# Altium project 2GHz_TDD_Driver.PrjPcb
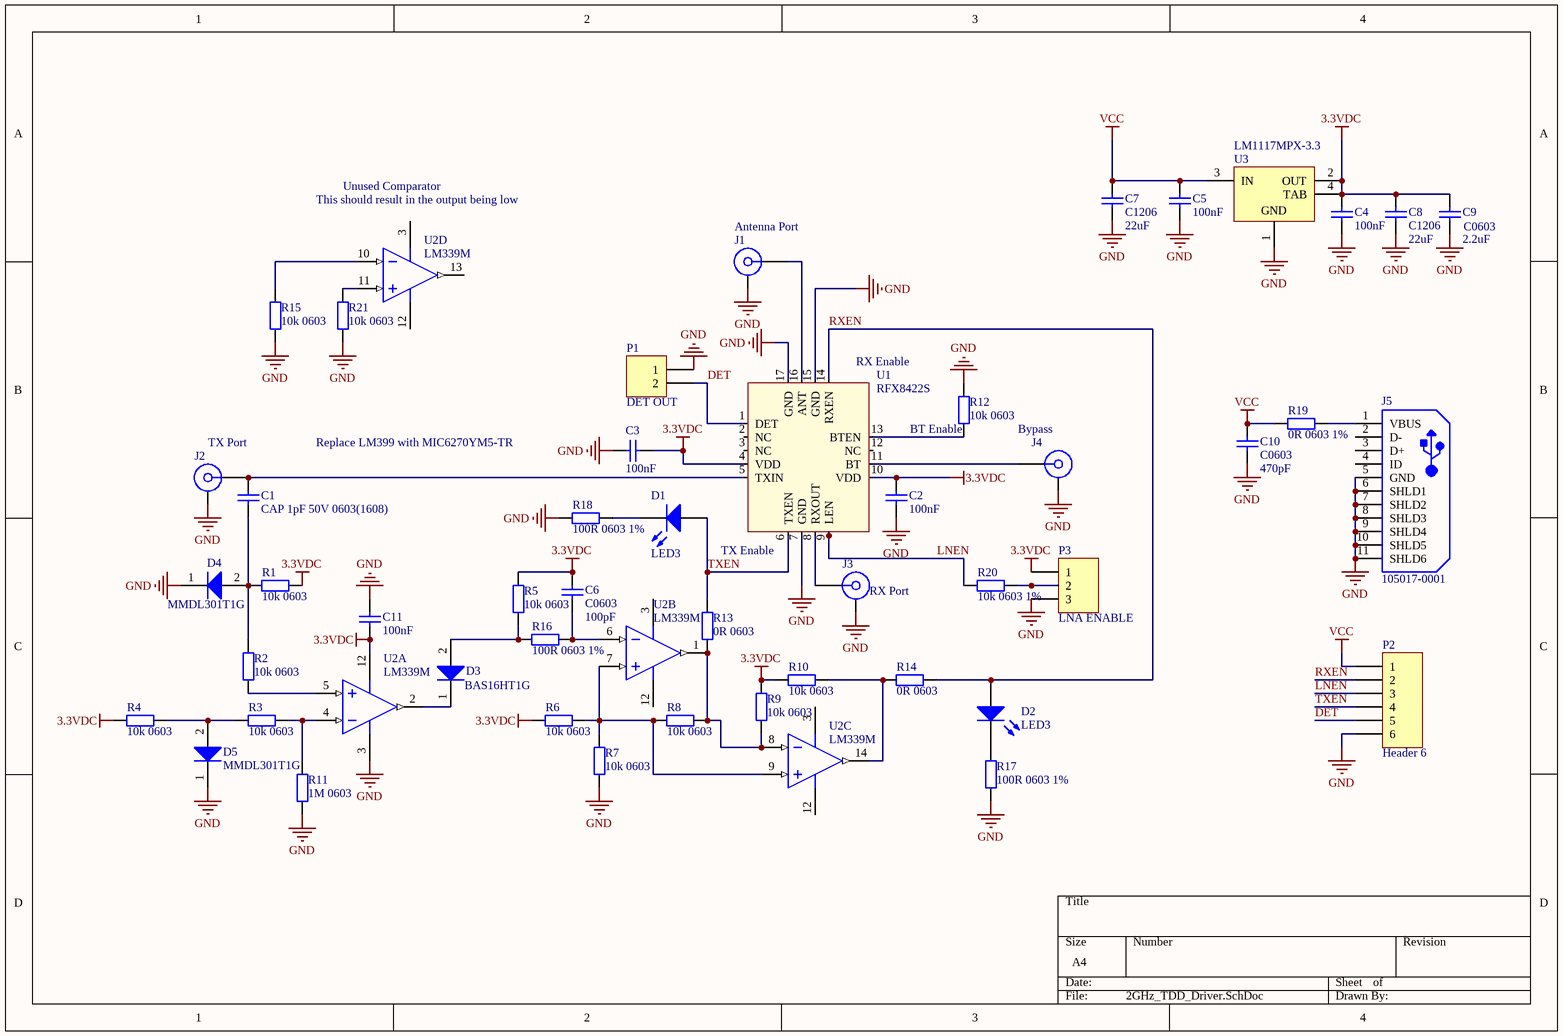
[diagram p0: 2GHz_TDD_Driver.SchDoc]
1 sheet, 48 parts. Net scope: global (net labels, ports and power ports of the same name join across sheets).
Board file: 2GHz_TDD_Driver.PcbDoc

## Sheet 2GHz_TDD_Driver.SchDoc: 2.4GHz TDD Driver
size A4; SheetNumber: 1; SheetTotal: 1; DocumentName: 2.4GHz TDD Driver; ProjectName: 2.4GHz TDD Driver

### Parts
C1  CAP 1pF 50V 0603(1608)  [CAPC0603(1608)100_M]
C2  100nF  [CAPC0603(1608)100_N]
C3  100nF  [CAPC0603(1608)100_N]
C4  100nF  [CAPC0603(1608)100_N]
C5  100nF  [CAPC0603(1608)100_N]
C6  C0603  value 100pF  [0603]
C7  C1206  value 22uF  [1206]
C8  C1206  value 22uF  [1206]
C9  C0603  value 2.2uF  [0603]
C10  C0603  value 470pF  [0603]
C11  100nF  [CAPC0603(1608)100_N]
D1  LED3  [3.5X2.8X1.9]
D2  LED3  [3.5X2.8X1.9]
D3  BAS16HT1G  [ONSC-SOD-323-2-477-02_V]
D4  MMDL301T1G  [ONSC-SOD-323-2-477-02_V]
D5  MMDL301T1G  [ONSC-SOD-323-2-477-02_V]
J1  32K145-400L5  [ROS-32K145-400L5_V]  (value not drawn)
J2  32K145-400L5  [ROS-32K145-400L5_V]  (value not drawn)
J3  32K145-400L5  [ROS-32K145-400L5_V]  (value not drawn)
J4  32K145-400L5  [ROS-32K145-400L5_V]  (value not drawn)
J5  105017-0001  [USB-MICRO-B_V]
P1  DET OUT  [HDR1X2]
P2  Header 6  [HDR1X6]
P3  LNA ENABLE  [HDR1X3]
R1  10k 0603  [R0603]
R2  10k 0603  [R0603]
R3  10k 0603  [R0603]
R4  10k 0603  [R0603]
R5  10k 0603  [R0603]
R6  10k 0603  [R0603]
R7  10k 0603  [R0603]
R8  10k 0603  [R0603]
R9  10k 0603  [R0603]
R10  10k 0603  [R0603]
R11  1M 0603  [R0603]
R12  10k 0603  [R0603]
R13  0R 0603  [R0603]
R14  0R 0603  [R0603]
R15  10k 0603  [R0603]
R16  100R 0603 1%  [R0603]
R17  100R 0603 1%  [R0603]
R18  100R 0603 1%  [R0603]
R19  0R 0603 1%  [R0603]
R20  10k 0603 1%  [R0603]
R21  10k 0603  [R0603]
U1  RFX8422S  [QFN50P250X250X50_HS-17M]
U2  LM339M  [D0014A_N]  (parts A,B,C,D of 4)
U3  LM1117MPX-3.3  [DCY0004A_N]

### Nets
3.3VDC: C2.2 C3.1 C4.2 C6.2 C8.2 C9.2 C11.2 P3.1 R1.1 R4.1 R5.2 R6.1 R9.2 R10.1 U1.4(VDD) U1.10(VDD) U2.12(GND) U3.2(OUT) U3.4(TAB)
GND: C2.1 C3.2 C4.1 C5.1 C7.1 C8.1 C9.1 C10.1 C11.1 D4.1(K) D5.1(K) J1.MP J2.MP J3.MP J4.MP J5.5(GND) J5.6(SHLD1) J5.7(SHLD2) J5.8(SHLD3) J5.9(SHLD4) J5.10(SHLD5) J5.11(SHLD6) P1.1 P2.6 P3.3 R7.1 R11.1 R12.2 R15.1 R17.1 R18.2 R21.1 U1.7(GND) U1.15(GND) U1.17(GND) U2.3(V+) U3.1(GND)
VCC: C5.2 C7.2 C10.2 P2.1 R19.1 U3.3(IN)
DET: P1.2 P2.5 U1.1(DET)
LNEN: P2.3 R20.1 U1.9(LEN)
RXEN: D2.1(A) P2.2 R14.2 U1.14(RXEN)
TXEN: D1.1(A) P2.4 R13.2 U1.6(TXEN)
NetC1_1: C1.1 D4.2(A) R1.2 R2.1
NetC1_2: C1.2 J2.1 U1.5(TXIN)
NetC6_1: C6.1 R16.2 U2.6(IN2-)
NetD1_2: D1.2(K) R18.1
NetD2_2: D2.2(K) R17.2
NetD3_1: D3.1(K) U2.2(OUT1)
NetD3_2: D3.2(A) R5.1 R16.1
NetD5_2: D5.2(A) R3.1 R4.2
NetJ1_1: J1.1 U1.16(ANT)
NetJ3_1: J3.1 U1.8(RXOUT)
NetJ4_1: J4.1 U1.11(BT)
NetJ5_1: J5.1(VBUS) R19.2
NetP3_2: P3.2 R20.2
NetR2_2: R2.2 U2.5(IN1+)
NetR3_2: R3.2 R11.2 U2.4(IN1-)
NetR6_2: R6.2 R7.2 R8.1 U2.7(IN2+) U2.9(IN3+)
NetR8_2: R8.2 R9.1 R13.1 U2.1(OUT2) U2.8(IN3-)
NetR10_2: R10.2 R14.1 U2.14(OUT3)
NetR12_1: R12.1 U1.13(BTEN)
NetR15_2: R15.2 U2.10(IN4-)
NetR21_2: R21.2 U2.11(IN4+)

Not connected (* = marked no-connect by the designer): J5 2(D-) 3(D+) 4(ID); U1 2(NC) 3(NC) 12(NC); U2 13(OUT4)

### Notes on the sheet
- (near U2) This should result in the output being low
- Unused Comparator
- (near J1) Antenna Port
- (near U1) RX Enable
- TX Port
- Replace LM399 with MIC6270YM5-TR
- (near R12) BT Enable
- (near J4) Bypass
- (near U1) TX Enable
- (near J3) RX Port

### Library data of the parts
C1 = CMP-1035-00040-1: CAP 1pF 50V ±0.25pF 0603 (1608 Metric) Thickness 1mm SMD; Case-EIA: 0603; Tolerance: Â±0.25pF; Case-Metric: 1608; Max Thickness: 1 mm; Value: 1pF; Technology: SMT; Rated Voltage: 50 V
C2-C5 C11 = CMP-1035-02589-1: CAP 100nF 25V ±20% 0603 (1608 Metric) Thickness 1mm SMD; Case-EIA: 0603; Tolerance: Â±20%; Case-Metric: 1608; Value: 100nF; Max Thickness: 1 mm; Technology: SMT; Rated Voltage: 25 V
C6 C9 C10 = C0603: Ceramic Chip Capacitor - Standard; Note: Footprint corresponds to dimensions for bulk cassette packaging. This case size has tightened tolerances.; Published: 17-Jul-2002; LatestRevisionDate: 19-Mar-2004; LatestRevisionNote: Silkscreen size reduced.; DatasheetDocument: Mar-2001; PackageDocument: Mar-2001; PackageReference: 0603; Publisher: Altium Limited; Code_JEITA: 0603; Code_IPC: 1608 [0603]; ComponentLink1Description: Manufacturer Link; ComponentLink1URL: http://www.kemet.com/; ComponentLink2Description: Datasheet; ComponentLink2URL: http://www.kemet.com/kemet/web/homepage/kechome.nsf/vapubfilesname/F3102TA.pdf/$file/F3102TA.pdf
C7 C8 = C1206: Ceramic Chip Capacitor - Standard; Published: 17-Jul-2002; LatestRevisionDate: 19-Mar-2004; LatestRevisionNote: Silkscreen size reduced.; DatasheetDocument: Mar-2001; PackageDocument: Mar-2001; PackageReference: 1206; Publisher: Altium Limited; Code_JEITA: 1206; Code_IPC: 3216 [1206]; ComponentLink1Description: Manufacturer Link; ComponentLink1URL: http://www.kemet.com/; ComponentLink2Description: Datasheet; ComponentLink2URL: http://www.kemet.com/kemet/web/homepage/kechome.nsf/vapubfilesname/F3102TA.pdf/$file/F3102TA.pdf
D1 D2 = LED3: Typical BLUE SiC LED; Published: 8-Jun-2000; LatestRevisionDate: 17-Dec-2003; LatestRevisionNote: PCB Footprint replaced.; DatasheetVersion: 16-Apr-2002; PackageVersion: 16-Apr-2002; PackageReference: 3.5X2.8X1.9; Publisher: Altium Limited; PackageDescription: SM LED; 2 C-Bend Leads; Body 3.5 x 2.8 x 1.9 mm, inc leads (LxWxH typ)
D3 = CMP-1054-00068-1: Switching Diode, 2-Pin SOD-323, Pb-Free, Tape and Reel; Manufacturer: On Semiconductor; Configuration: Single; IF Max (A): 0.2; trr Max (ns): 6; Packing: Tape and Reel; ComponentLink2URL: http://www.onsemi.com/pub_link/Collateral/BAS16HT1-D.PDF; ComponentLink3Description: Package Specification; RoHS: TRUE; PackageDescription: 2-Pin SOD, Body 1.7 x 1.25 mm; PackageReference: SOD-323-2-477-02; PartNumber: BAS16HT1G; ComponentLink1URL: http://www.onsemi.com/; Mounting Technology: Surface Mount; ComponentLink1Description: Manufacturer URL; ComponentLink2Description: Datasheet; DatasheetVersion: Rev. 11; PackageVersion: Rev. H, 03/2007; ComponentLink3URL: http://www.onsemi.com/pub_link/Collateral/477-02.PDF.1
D4 D5 = CMP-1051-00017-1: Silicon Hot-Carrier Diode, Schottky Barrier Diode, 2-Pin SOD-323, Pb-Free, Tape and Reel; Manufacturer: On Semiconductor; Configuration: Single; Packing: Tape and Reel; PartNumber: MMDL301T1G; ComponentLink2Description: Datasheet; PackageDescription: 2-Pin SOD, Body 1.7 x 1.25 mm; ComponentLink1URL: http://www.onsemi.com/; PackageReference: SOD-323-2-477-02; ComponentLink3URL: http://www.onsemi.com/pub_link/Collateral/477-02.PDF.1; ComponentLink1Description: Manufacturer URL; DatasheetVersion: Rev. 2; Mounting Technology: Surface Mount; ComponentLink2URL: http://www.onsemi.cn/pub_link/Collateral/MMDL301T1-D.PDF; PackageVersion: Rev. H, 03/2007; ComponentLink3Description: Package Specification; RoHS: TRUE
J1-J4 = 32K145-400L5: SMA Right Angle Jack, Edge Mount, Up to 18 GHz, -55 to 155 degC; Design Note 1: Footprint in library is a generic example - only application specific footprint delivers High Performance; Desgin Note 2: For more information about DRC setting, please look at following webpage, http://techdocs.altium.com/display/SCRT/Design+Rule+for+Edge-Mount+Connectors; DatasheetVersion: b00; PackageVersion: b00; PackageReference: 32K145-400L5; PackageDescription: SMA Right Angle Jack, Edge Mount, 14.25 x 9.5 x 4.46 mm; Mounting Technology: Surface Mount; PartNumber: 32K145-400L5; ComponentLink1Description: Manufacturer URL; ComponentLink1URL: http://www.rosenberger.de; ComponentLink2Description: Datasheet; ComponentLink2URL: http://rosenberger.de/ok/images/documents/db/32K145-400L5.pdf; ComponentLink3Description: Package Specification; ComponentLink3URL: http://rosenberger.de/ok/images/documents/db/32K145-400L5.pdf; ComponentLink4Description: Series Overview / Design Note; ComponentLink4URL: http://rosenberger.de/ok/images/documents/spez/32.pdf; ComponentLink5Description: Webshop / RFQ; ComponentLink5URL: http://www.rosenberger.com/en/contact/sales/
J5 = CMP-2000-05827-1: Micro-USB B Receptacle, Right Angle, Bottom Mount, Surface Mount, with Solder Tabs, -30 to 85 degC, 5-Pin USB, RoHS, Tape and Reel; Manufacturer: Molex; Featured Product: Micro-USBConnectorsUSBConnectors; Other Names: WM1399DKR; Package Version: Rev. F, 12/2012; Number of Contacts: 5; Connector Type: USB-microB; Catalog Drawings: 1050170001; 3D Model: 105017-0001.stp; Mating Products: WM17145-ND-CABLEMICROUSBBTOSTDA1.0MWM17147-ND-CABLEMICROUSBBTOSTDA2.0MWM17146-ND-CABLEMICROUSBBTOSTDA1.5M; PCN Assembly/Origin: ResinSupplier21/Oct/2015; Voltage - Max: 30V; Online Catalog: Molex-MicroUSB; Manufacturer URL: http://www.molex.com/; Package Description: 5-Leads USB, Micro B, Body 7.5 x 5 mm, Pitch 0.65 mm; Datasheet URL: http://www.molex.com/elqNow/elqRedir.htm?ref=http://www.molex.com/webdocs/datasheets/pdf/en-us/1050170001_IO_CONNECTORS.pdf; Ingress Protection: -; Datasheet Version: 03/2016; Mounting Type: BoardCutout,SurfaceMount,RightAngle; Circuits: 5; Standard Package: 1; Package Reference: MICRO-B; Package URL: http://www.molex.com/pdm_docs/sd/1050170001_sd.pdf; Category: Connectors,Interconnects; Series: -; RoHS Information: 1050170001CertofCompliance; Features: Shielded,SolderRetention; Family: USB,DVI,HDMIConnectors; Specifications: -; Gender: Receptacle; Packaging: Digi-Reel®; Mounting Technology: SurfaceMount
P1 = Header 2: Header, 2-Pin; LatestRevisionDate: 17-Jul-2002; LatestRevisionNote: Re-released for DXP Platform.; Publisher: Altium Limited
P2 = Header 6: Header, 6-Pin; LatestRevisionDate: 17-Jul-2002; LatestRevisionNote: Re-released for DXP Platform.; Publisher: Altium Limited
P3 = Header 3: Header, 3-Pin; LatestRevisionDate: 17-Jul-2002; LatestRevisionNote: Re-released for DXP Platform.; Publisher: Altium Limited
R1-R10 R12 R15 R20 R21 = 10k 0603: 10k 0603 1% resistor; Value: 10k; Case: 0603 Imperial; Publisher: iv
  R20: Tolerance: 1%
R11 = 0R 0603: 1M 0603 1%; Value: 1M; Case: 0603
R13 R14 = 0R 0603: 0R 0603 1%
  R13: Value: 0R; Case: 0603
R16-R18 = 100R 0603: Publisher: iv; Case: 0603; Value: 100R; Tolerance: 1%
R19 = 0R 0603: Value: 0R; Case: 0603; Tolerance: 1%; Publisher: iv
U1 = RFX8422S: 2.4GHZ PA+LNA+SW +21dBm; Manufacturer: Skyworks Solutions; Supplier 1: Mouser; Manufacturer Part Number: RFX8422S; Stock 1: 0; Supplier Part Number 1: 477-RFX8422S
U2 = CMP-0055-00762-3: Low Power Low Offset Voltage Quad Comparator, 14-pin Narrow SOIC; Manufacturer: Texas Instruments; PackageTopMarking: NSUZXYTTE#*LM339M; CompType: Amplifiers; PowerWise: N; RoHS: N; Code_JEDEC: MS-012AB; ComponentLink1Description: Datasheet URL; Package Reference: D0014A; ComponentLink1URL: http://www.ti.com/general/docs/lit/getliterature.tsp?genericPartNumber=LM339-N&fileType=pdf; Code_IPC: SOIC127P600-14; PackageDescription: Molded Package S.O., .150in Wide, 14 Lead; PinCount: 14
U3 = CMP-0062-01659-4: 800mA Low-Dropout Linear Regulator, 4-pin SOT-223; Manufacturer: Texas Instruments; PackageTopMarking: XYTT*N05A; High-Reliability: Y; PowerWise: N; CompType: LDO IC; PackageDescription: Molded SOT-223, 6.50 x 3.56 x 1.6mm Body, 4 Lead, 2.3mm Pitch; PackageReference: DCY0004A; ComponentLink1Description: Datasheet URL; PartNumber: LM1117MPX-3.3; RoHS: N; PinCount: 4; Code_IPC: SOT223-4; Code_JEDEC: TO-261-AA; ComponentLink1URL: http://www.ti.com/general/docs/lit/getliterature.tsp?genericPartNumber=LM1117-N&fileType=pdf